# Altium schematic sheet Motor_Driver.SchDoc: Sterownik Silników
size A4 portrait; SheetNumber: 4; SheetTotal: 5; Cel: Ehh; Projektant: Teodor
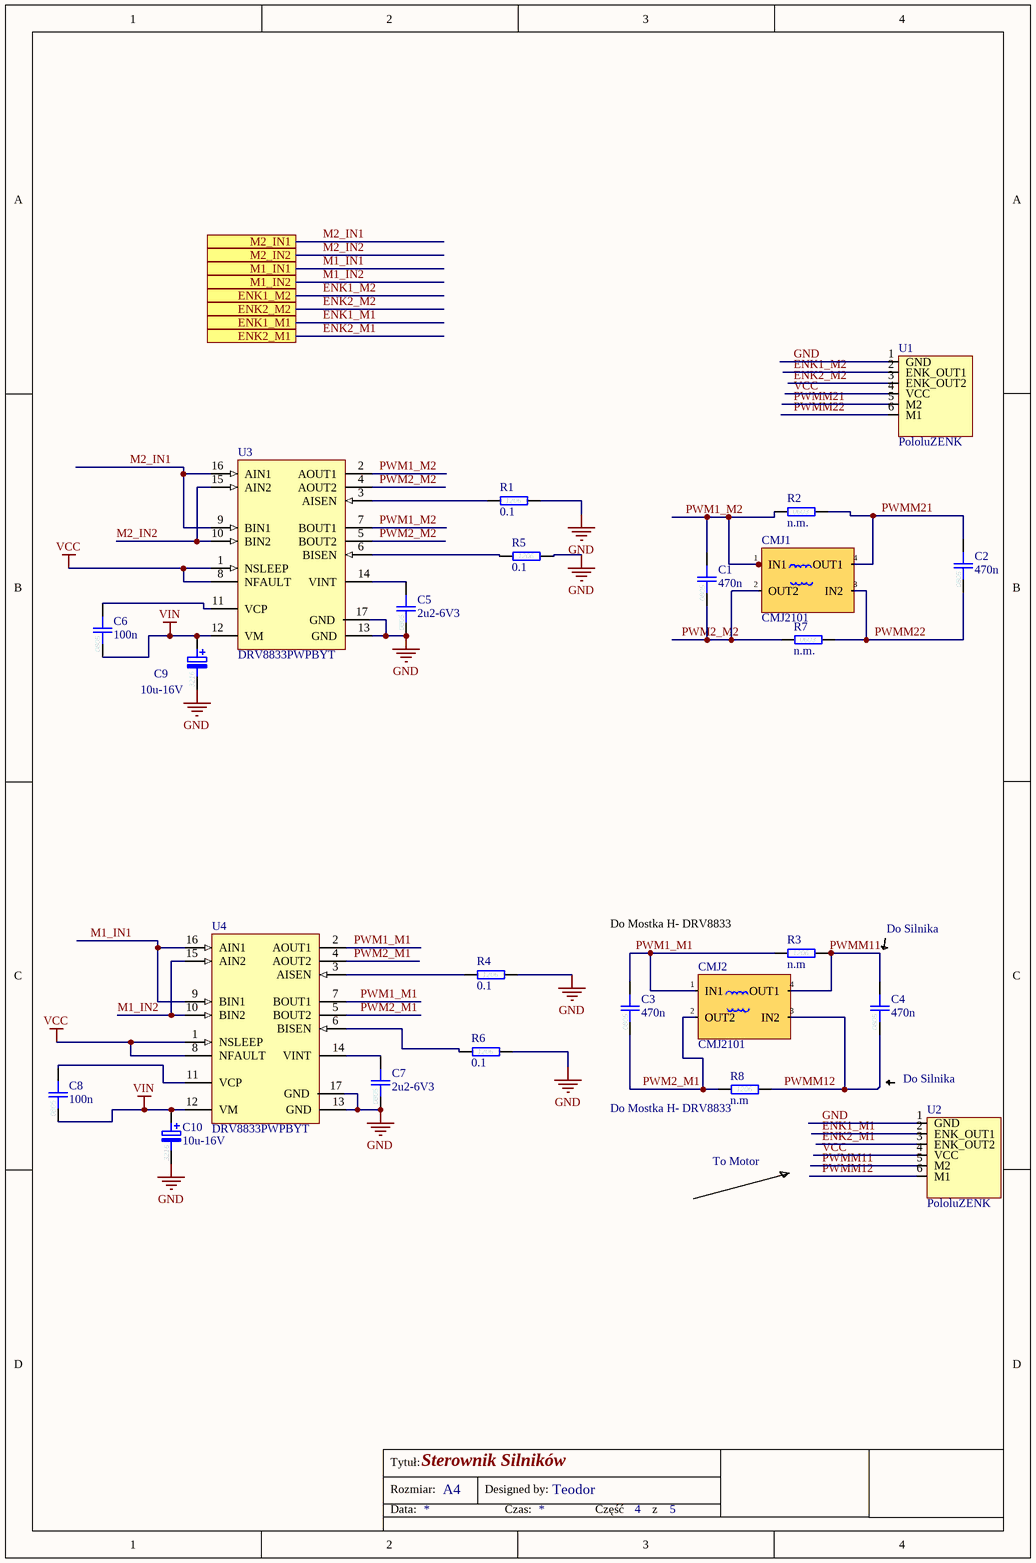
[diagram p0: Motor_Driver.SchDoc]

## Parts
C1  470n  [0805C]
C2  470n  [0805C]
C3  470n  [0805C]
C4  470n  [0805C]
C5  2u2-6V3  [0805C]
C6  100n  [0805C]
C7  2u2-6V3  [0805C]
C8  100n  [0805C]
C9  10u-16V  [3216-SMDA]
C10  10u-16V  [3216-SMDA]
CMJ1  CMJ2101  [CMJ2101FP]
CMJ2  CMJ2101  [CMJ2101FP]
R1  0.1  [1206R]
R2  n.m.  [0603R]  (no BOM)
R3  n.m  [1206R]
R4  0.1  [1206R]
R5  0.1  [1206R]
R6  0.1  [1206R]
R7  n.m.  [0603R]  (no BOM)
R8  n.m  [1206R]
U1  PololuZENK  [PololuzENK]
U2  PololuZENK  [PololuzENK]
U3  DRV8833PWPBYT  [DRV8833PWPBYTEOR]
U4  DRV8833PWPBYT  [DRV8833PWPBYTEOR]

## Ports
ENK1_M1, ENK1_M2, ENK2_M1, ENK2_M2, M1_IN1, M1_IN2, M2_IN1, M2_IN2

## Nets
GND: C5.2 C7.2 C9.2 C10.2 R1.2 R4.2 R5.2 R6.2 U1.1(GND) U2.1(GND) U3.13(GND) U3.17(GND) U4.13(GND) U4.17(GND)
VCC: U1.4(VCC) U2.4(VCC) U3.1(NSLEEP) U3.8(NFAULT) U4.1(NSLEEP) U4.8(NFAULT)
VIN: C6.2 C8.2 C9.1 C10.1 U3.12(VM) U4.12(VM)
ENK1_M1: U2.2(ENK_OUT1) ; port ENK1_M1
ENK1_M2: U1.2(ENK_OUT1) ; port ENK1_M2
ENK2_M1: U2.3(ENK_OUT2) ; port ENK2_M1
ENK2_M2: U1.3(ENK_OUT2) ; port ENK2_M2
M1_IN1: U4.9(BIN1) U4.16(AIN1) ; port M1_IN1
M1_IN2: U4.10(BIN2) U4.15(AIN2) ; port M1_IN2
M2_IN1: U3.9(BIN1) U3.16(AIN1) ; port M2_IN1
M2_IN2: U3.10(BIN2) U3.15(AIN2) ; port M2_IN2
PWM1_M1: C3.1 CMJ2.1(IN1) R3.1 U4.2(AOUT1) U4.7(BOUT1)
PWM1_M2: C1.1 CMJ1.1(IN1) R2.1 U3.2(AOUT1) U3.7(BOUT1)
PWM2_M1: C3.2 CMJ2.2(OUT2) R8.1 U4.4(AOUT2) U4.5(BOUT2)
PWM2_M2: C1.2 CMJ1.2(OUT2) R7.1 U3.4(AOUT2) U3.5(BOUT2)
PWMM11: C4.1 CMJ2.4(OUT1) R3.2 U2.5(M2)
PWMM12: C4.2 CMJ2.3(IN2) R8.2 U2.6(M1)
PWMM21: C2.1 CMJ1.4(OUT1) R2.2 U1.5(M2)
PWMM22: C2.2 CMJ1.3(IN2) R7.2 U1.6(M1)
NetC5_1: C5.1 U3.14(VINT)
NetC6_1: C6.1 U3.11(VCP)
NetC7_1: C7.1 U4.14(VINT)
NetC8_1: C8.1 U4.11(VCP)
NetR1_1: R1.1 U3.3(AISEN)
NetR4_1: R4.1 U4.3(AISEN)
NetR5_1: R5.1 U3.6(BISEN)
NetR6_1: R6.1 U4.6(BISEN)

## Notes on the sheet
- Do Mostka H- DRV8833
- Do Silnika
- (near R8) Do Mostka H- DRV8833
- To Motor
- Tytuł:
- Rozmiar:
- Data:
- A4
- Designed by:
- Czas:
- Część
- z
- (in symbol 0R12-1%  1206) 1206
- (in symbol 2u2-6V3  0805) 0805
- (in symbol 10u-16V  3216) 3216
- (in symbol 100n  0805) 0805
- (in symbol n.m.  0603) 0603

## Library data of the parts
C1-C4 = 100n  0805: Kond. ceramiczny X7R  50V  10%; Indeks: 5566; Nazwa: 100n
C5 C7 = 2u2-6V3  0805: Kond. ceramiczny X7R  6V3  10%; Indeks: 20978; Nazwa: 2u2-6V3
C6 C8 = 100n  0805: Kond. ceramiczny X7R  50V  10%; Indeks: 5566; Nazwa: 100n
C9 C10 = 10u-16V  3216: Kond. tantalowy  A  16V  20%; Indeks: 12471; Nazwa: 10u-16V
CMJ1 CMJ2 = CMJ2101: Dlawik 100uH 500mA
R1 R3-R6 R8 = 0R12-1%  1206: Rezystor 0,25W; Nazwa: 0R12-1%
R2 R7 = n.m.  0603: Rezystor 0,063W; Indeks: -; Nazwa: n.m.
U3 U4 = DRV8833PWPBYT: Mostek caly by TEOR